# Altium schematic sheet Voltage detectV2.SchDoc
size A4; ENG_APP_DATE: --/--/--; DSN_APP_DATE: --/--/--; CHK_APP_DATE: --/--/--; Название устройства: Voltage dect V2
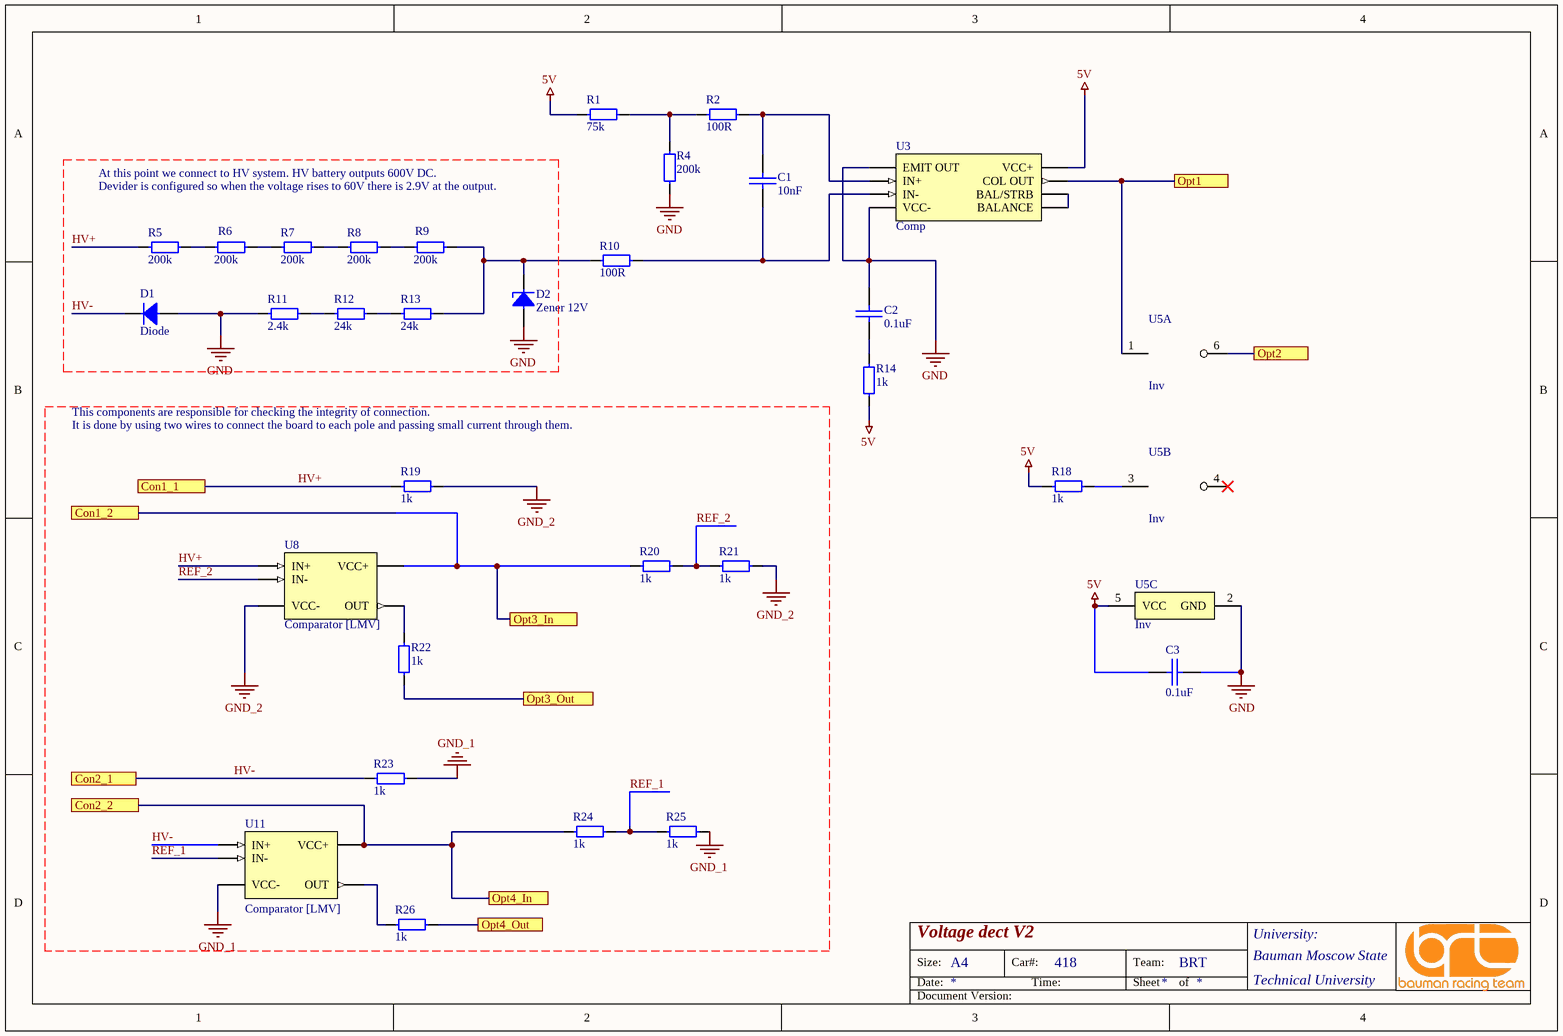
[diagram p0: Voltage detectV2.SchDoc]

## Parts
C1  10nF  [0805 Capicator]
C2  0.1uF  [0805 Capicator]
C3  0.1uF  [0805 Capicator]
D1  Diode  [DO-41]
D2  Zener 12V  [sod-323]
R1  75k  [0805 Resistor]
R2  100R  [0805 Resistor]
R4  200k  [0805 Resistor]
R5  200k  [0805 Resistor]
R6  200k  [0805 Resistor]
R7  200k  [0805 Resistor]
R8  200k  [0805 Resistor]
R9  200k  [0805 Resistor]
R10  100R  [0805 Resistor]
R11  2.4k  [0805 Resistor]
R12  24k  [0805 Resistor]
R13  24k  [0805 Resistor]
R14  1k  [0805 Resistor]
R18  1k  [0805 Resistor]
R19  1k  [0805 Resistor]
R20  1k  [0805 Resistor]
R21  1k  [0805 Resistor]
R22  1k  [0805 Resistor]
R23  1k  [0805 Resistor]
R24  1k  [0805 Resistor]
R25  1k  [0805 Resistor]
R26  1k  [0805 Resistor]
U3  Comp  [SOIC-8]
U5  Inv  [SOT236]  (parts A,B,C of 3)
U8  Comparator [LMV]  [SOT-23-5]
U11  Comparator [LMV]  [SOT-23-5]

## Ports
Con1_1, Con1_2, Con2_1, Con2_2, Opt1, Opt2, Opt3_In, Opt3_Out, Opt4_In, Opt4_Out

## Nets
5V: C3.1 R1.1 R14.1 R18.2 U3.8(VCC+) U5.5(VCC)
 GND: C2.2 C3.2 D1.1 D2.1 R4.1 R11.1 U3.1(EMIT_OUT) U3.4(VCC-) U5.2(GND)  [also labelled GND]
GND_1: R23.1 R25.1 U11.2(VCC-)
GND_2: R19.1 R21.1 U8.2(VCC-)
Con1_2: R20.2 U8.5(VCC+) ; port Opt3_In, port Con1_2
Con2_2: R24.2 U11.5(VCC+) ; port Con2_2, port Opt4_In
HV+: R5.1 R19.2 U8.1(IN+) ; port Con1_1
HV-: D1.2 R23.2 U11.1(IN+) ; port Con2_1
Opt1: U3.7(COL_OUT) U5.1(1A) ; port Opt1
Opt2: U5.6(1Y) ; port Opt2
Opt3_Out: R22.2 ; port Opt3_Out
Opt4_Out: R26.2 ; port Opt4_Out
REF_1: R24.1 R25.2 U11.3(IN-)
REF_2: R20.1 R21.2 U8.3(IN-)
NetC1_1: C1.1 R10.2 U3.3(IN-)
NetC1_2: C1.2 R2.2 U3.2(IN+)
NetC2_1: C2.1 R14.2
NetD2_2: D2.2 R9.2 R10.1 R13.2
NetR1_2: R1.2 R2.1 R4.2
NetR5_2: R5.2 R6.1
NetR6_2: R6.2 R7.1
NetR7_2: R7.2 R8.1
NetR8_2: R8.2 R9.1
NetR11_2: R11.2 R12.2
NetR12_1: R12.1 R13.1
NetR18_1: R18.1 U5.3(2А)
NetR22_1: R22.1 U8.4(OUT)
NetR26_1: R26.1 U11.4(OUT)
NetU3_5: U3.5(BALANCE) U3.6(BAL/STRB)

Not connected (* = marked no-connect by the designer): U5 4(2Y)*

## Notes on the sheet
- At this point we connect to HV system. HV battery outputs 600V DC.
- Devider is configured so when the voltage rises to 60V there is 2.9V at the output.
- This components are responsible for checking the integrity of connection.
- (near R19) It is done by using two wires to connect the board to each pole and passing small current through them.
- Size:
- Date:
- A4
- Car#:
- Time:
- 418
- Team:
- Sheet
- BRT
- of
- University:
- Technical University
- Bauman Moscow State
- Document Version:

## Library data of the parts
C1 = Cap 10nF (0805): 0805 X7R 10nF 100V 10%; Manufacturer: Murata Manufacturing; Part Number: GRM21BR72A103KA01L; Type: Capacitor; ComponentLink1Description: Chip&Dip; ComponentLink1URL: https://www.chipdip.ru/product/grm21br72a103ka01l
C2 C3 = Cap 0.1uF (0805): 0.1uF X7R 25V 10% 0805; Manufacturer: Murata Manufacturing; Part Number: GRM21BR71E104KA01L; Type: Capacitor; ComponentLink1Description: Chip&Dip; ComponentLink1URL: https://www.chipdip.ru/product/grm21br71e104ka01l
D1 = Diode HV [EM5]: Highg voltage diode - 2000V; Part Number: EM518; Manufacturer: China; ComponentLink1Description: ChipDip; ComponentLink1URL: https://www.chipdip.ru/product/em518; ComponentLink2Description: Datasheet; ComponentLink2URL: https://static.chipdip.ru/lib/004/DOC001004767.pdf; Type: Diode
D2 = Zener Diode 12V: 300mW; Part Number: BZX384-C12,115; Manufacturer: NXP Semiconductor; Type: Diode; ComponentLink1Description: Chip&Dip; ComponentLink1URL: https://www.chipdip.ru/product/bzx384-c12.115; ComponentLink2Description: DataSheet; ComponentLink2URL: https://static.chipdip.ru/lib/583/DOC001583013.pdf
R1 = Res 75k (0805): 0.125W 0805 75k, 1%; Part Number: RC0805FR-0775KL; Manufacturer: Taiwan; Type: Resistor; ComponentLink1Description: Chip&Dip; ComponentLink1URL: https://www.chipdip.ru/product0/9000079535
R2 R10 = Res 100R (0805): 0.125W 0805 100R, 1%; Part Number: RC0805FR-07100RL; Manufacturer: Taiwan; Type: Resistor; ComponentLink1Description: Chip&Dip; ComponentLink1URL: https://www.chipdip.ru/product0/9000079462
R4-R9 = Res 200k (0805): 0.125W 0805 200k, 1%; Part Number: RC0805FK-07200KL; Manufacturer: Taiwan; Type: Resistor; ComponentLink1Description: Chip&Dip; ComponentLink1URL: https://www.chipdip.ru/product0/914213016
R11 = Res 2.4k (0805): 0.125W 0805 2.4k, 1%; Part Number: RC0805FR-072K4L; Manufacturer: Taiwan; Type: Resistor; ComponentLink1Description: Chip&Dip; ComponentLink1URL: https://www.chipdip.ru/product0/9000079495
R12 R13 = Res 24k (0805): 0.125W 0805 24k, 1%; Part Number: RC0805FR-0724KL; Manufacturer: Taiwan; Type: Resistor; ComponentLink1Description: Chip&Dip; ComponentLink1URL: https://www.chipdip.ru/product0/9000079523
R14 R18-R26 = Res 1k (0805): 0.125W 0805 1k, 1%; Part Number: RC0805FR-071KL; Manufacturer: Taiwan; Type: Resistor; ComponentLink1Description: Chip&Dip; ComponentLink1URL: https://www.chipdip.ru/product0/9000079486
U3 = Comparator [LM3]: Differential comparator with strobes; Part Number: LM311DR; Manufacturer: Texas Instruments; ComponentLink1Description: DataSheet; ComponentLink1URL: https://static.chipdip.ru/lib/222/DOC000222396.pdf; ComponentLink2Description: Chip&Dip; ComponentLink2URL: https://www.chipdip.ru/product/lm311d; Type: IC
U5 = Inverter (SN74): Dual inverter, 1.65-5.5V; Manufacturer: Texas Instruments; Part Number: SN74LVC2G04DBVR; ComponentLink1Description: Chip&Dip; ComponentLink1URL: https://www.chipdip.ru/product/sn74lvc2g04dbvr-2; ComponentLink2Description: DataSheet; ComponentLink2URL: https://static.chipdip.ru/lib/021/DOC001021810.pdf; Type: IC
U8 U11 = Comparator [LMV]: Differential comparator with strobes; Part Number: LMV331M5/NOPB; Manufacturer: Texas Instruments; ComponentLink2URL: https://www.chipdip.ru/product/lmv331m5-nopb; ComponentLink1URL: https://static.chipdip.ru/lib/291/DOC000291302.pdf; ComponentLink1Description: DataSheet; ComponentLink2Description: Chip&Dip; Type: IC